# Altium schematic sheet Güç.SchDoc
size A4; SheetNumber: 3; SheetTotal: 3
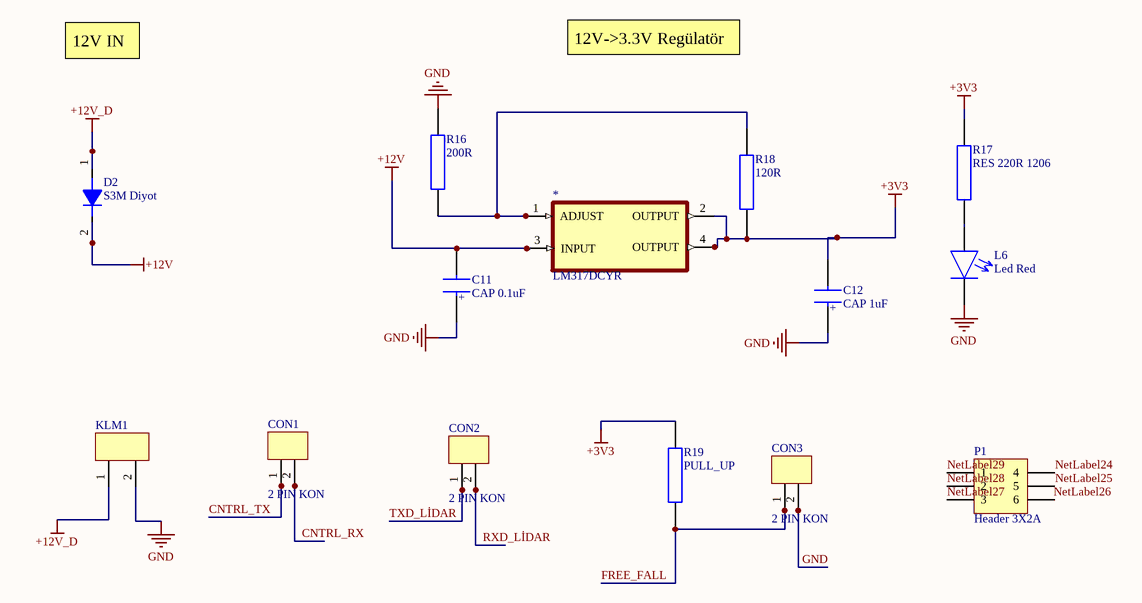
[diagram p0: Güç.SchDoc]

## Parts
*  LM317DCYR  [SOT230P700X180-4N]
C11  CAP 0.1uF  [CAP_805]
C12  CAP 1uF  [CAP_805]
CON1  2 PIN KON  [2 PIN 2.54MM]
CON2  2 PIN KON  [2 PIN 2.54MM]
CON3  2 PIN KON  [2 PIN 2.54MM]
D2  S3M Diyot  [DO214AA]
KLM1  2 Pin Klemens  [5.08mm-2 pin]  (value not drawn)
L6  Led Red  [Led 1206]
P1  Header 3X2A  [HDR2X3_CEN]
R16  200R  [RES_1206]
R17  RES 220R 1206  [RES_1206]
R18  120R  [RES_1206]
R19  PULL_UP  [RES_1206]

## Nets
+3V3: *.2(OUTPUT) *.4(OUTPUT) C12.2 R17.2 R18.2 R19.2
+12V: *.3(INPUT) C11.2 D2.2
+12V_D: D2.1 KLM1.1
GND: C11.1 C12.1 CON3.2 KLM1.2 L6.2 R16.2
CNTRL_RX: CON1.2
CNTRL_TX: CON1.1
FREE_FALL: CON3.1 R19.1
NetLabel24: P1.4
NetLabel25: P1.5
NetLabel27: P1.3
NetLabel28: P1.2
NetLabel29: P1.1
RXD_LİDAR: CON2.2
TXD_LİDAR: CON2.1
Net*_1: *.1(ADJUST) R16.1 R18.1
NetL6_1: L6.1 R17.1

Not connected (* = marked no-connect by the designer): P1 6

## Notes on the sheet
- 12V IN
- 12V->3.3V Regülatör
- Labels drawn without touching a wire or pin: NetLabel26
- (in symbol CAP 1uF) +

## Library data of the parts
C11 C12 = CAP 1uF: 0805 smd
CON1-CON3 = 2 PIN KON: 2.54 mm vertical
D2 = S3M Diyot: Current: 3A; Voltage: 1000V; Case/Package: DO214AA
KLM1 = 2 Pin Klemens: 5.08mm 2 pin klemens
P1 = Header 3X2A: Header, 3-Pin, Dual row; LatestRevisionDate: 17-Jul-2002; LatestRevisionNote: Re-released for DXP Platform.; Publisher: Altium Limited
R16 R18 = RES 820R 1206
R19 = RES 4.7K 1206